# Altium project SmartMeter.PrjPCB
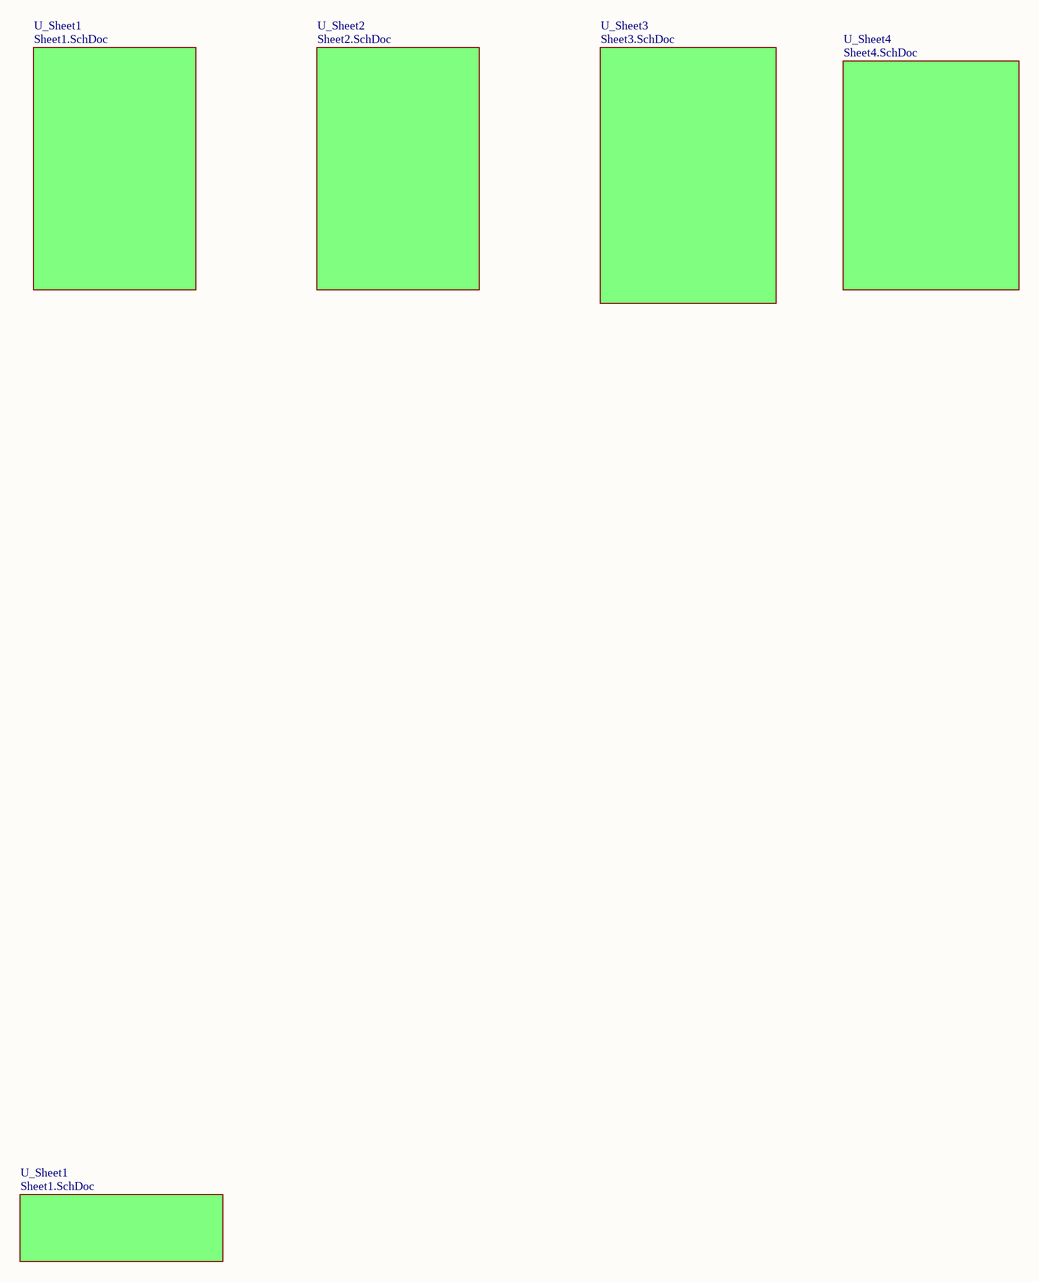
[diagram p0: SmartMeter.SchDoc]
4 sheets, 314 parts. Net scope: flat (ports and power ports of the same name join across sheets).
Board file: PCB1.PcbDoc
Sheets:
  SmartMeter.SchDoc
    U_Sheet1 = Sheet1.SchDoc
    U_Sheet1 = Sheet1.SchDoc
    U_Sheet2 = Sheet2.SchDoc
    U_Sheet3 = Sheet3.SchDoc

## Sheet SmartMeter.SchDoc: SMART METER _Main Board
size A3; SheetNumber: 3; ProjectName: Smart Meter

### Sub-sheets
U_Sheet1 = Sheet1.SchDoc: no entries
U_Sheet1 = Sheet1.SchDoc: no entries
U_Sheet2 = Sheet2.SchDoc: no entries
U_Sheet3 = Sheet3.SchDoc: no entries
U_Sheet4 = Sheet4.SchDoc (file not in this document): no entries

### Notes on the sheet
- Title
- Size:
- Date:
- A3
- Number:
- Time:
- Revision:
- Sheet
- of
- File:

## Sheet Sheet1.SchDoc
size A3
Used 2 times, as channels U_Sheet1, U_Sheet1. Parts and nets are listed once, with the designators drawn on the sheet.
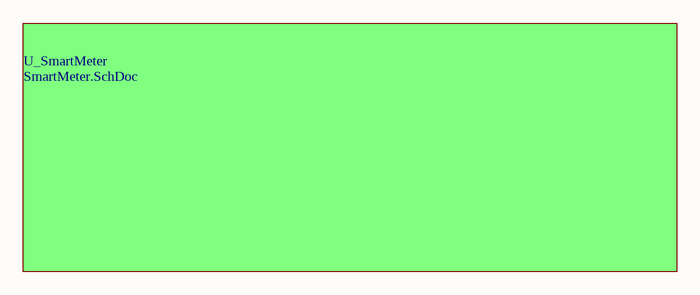
[diagram p1: Sheet1.SchDoc]

### Sub-sheets
U_SmartMeter = SmartMeter.SchDoc: no entries

### Channels
U_Sheet1: no parts or ports
U_Sheet1: no parts or ports

## Sheet Sheet2.SchDoc: SMART METER Main Board
size A3; SheetNumber: 2
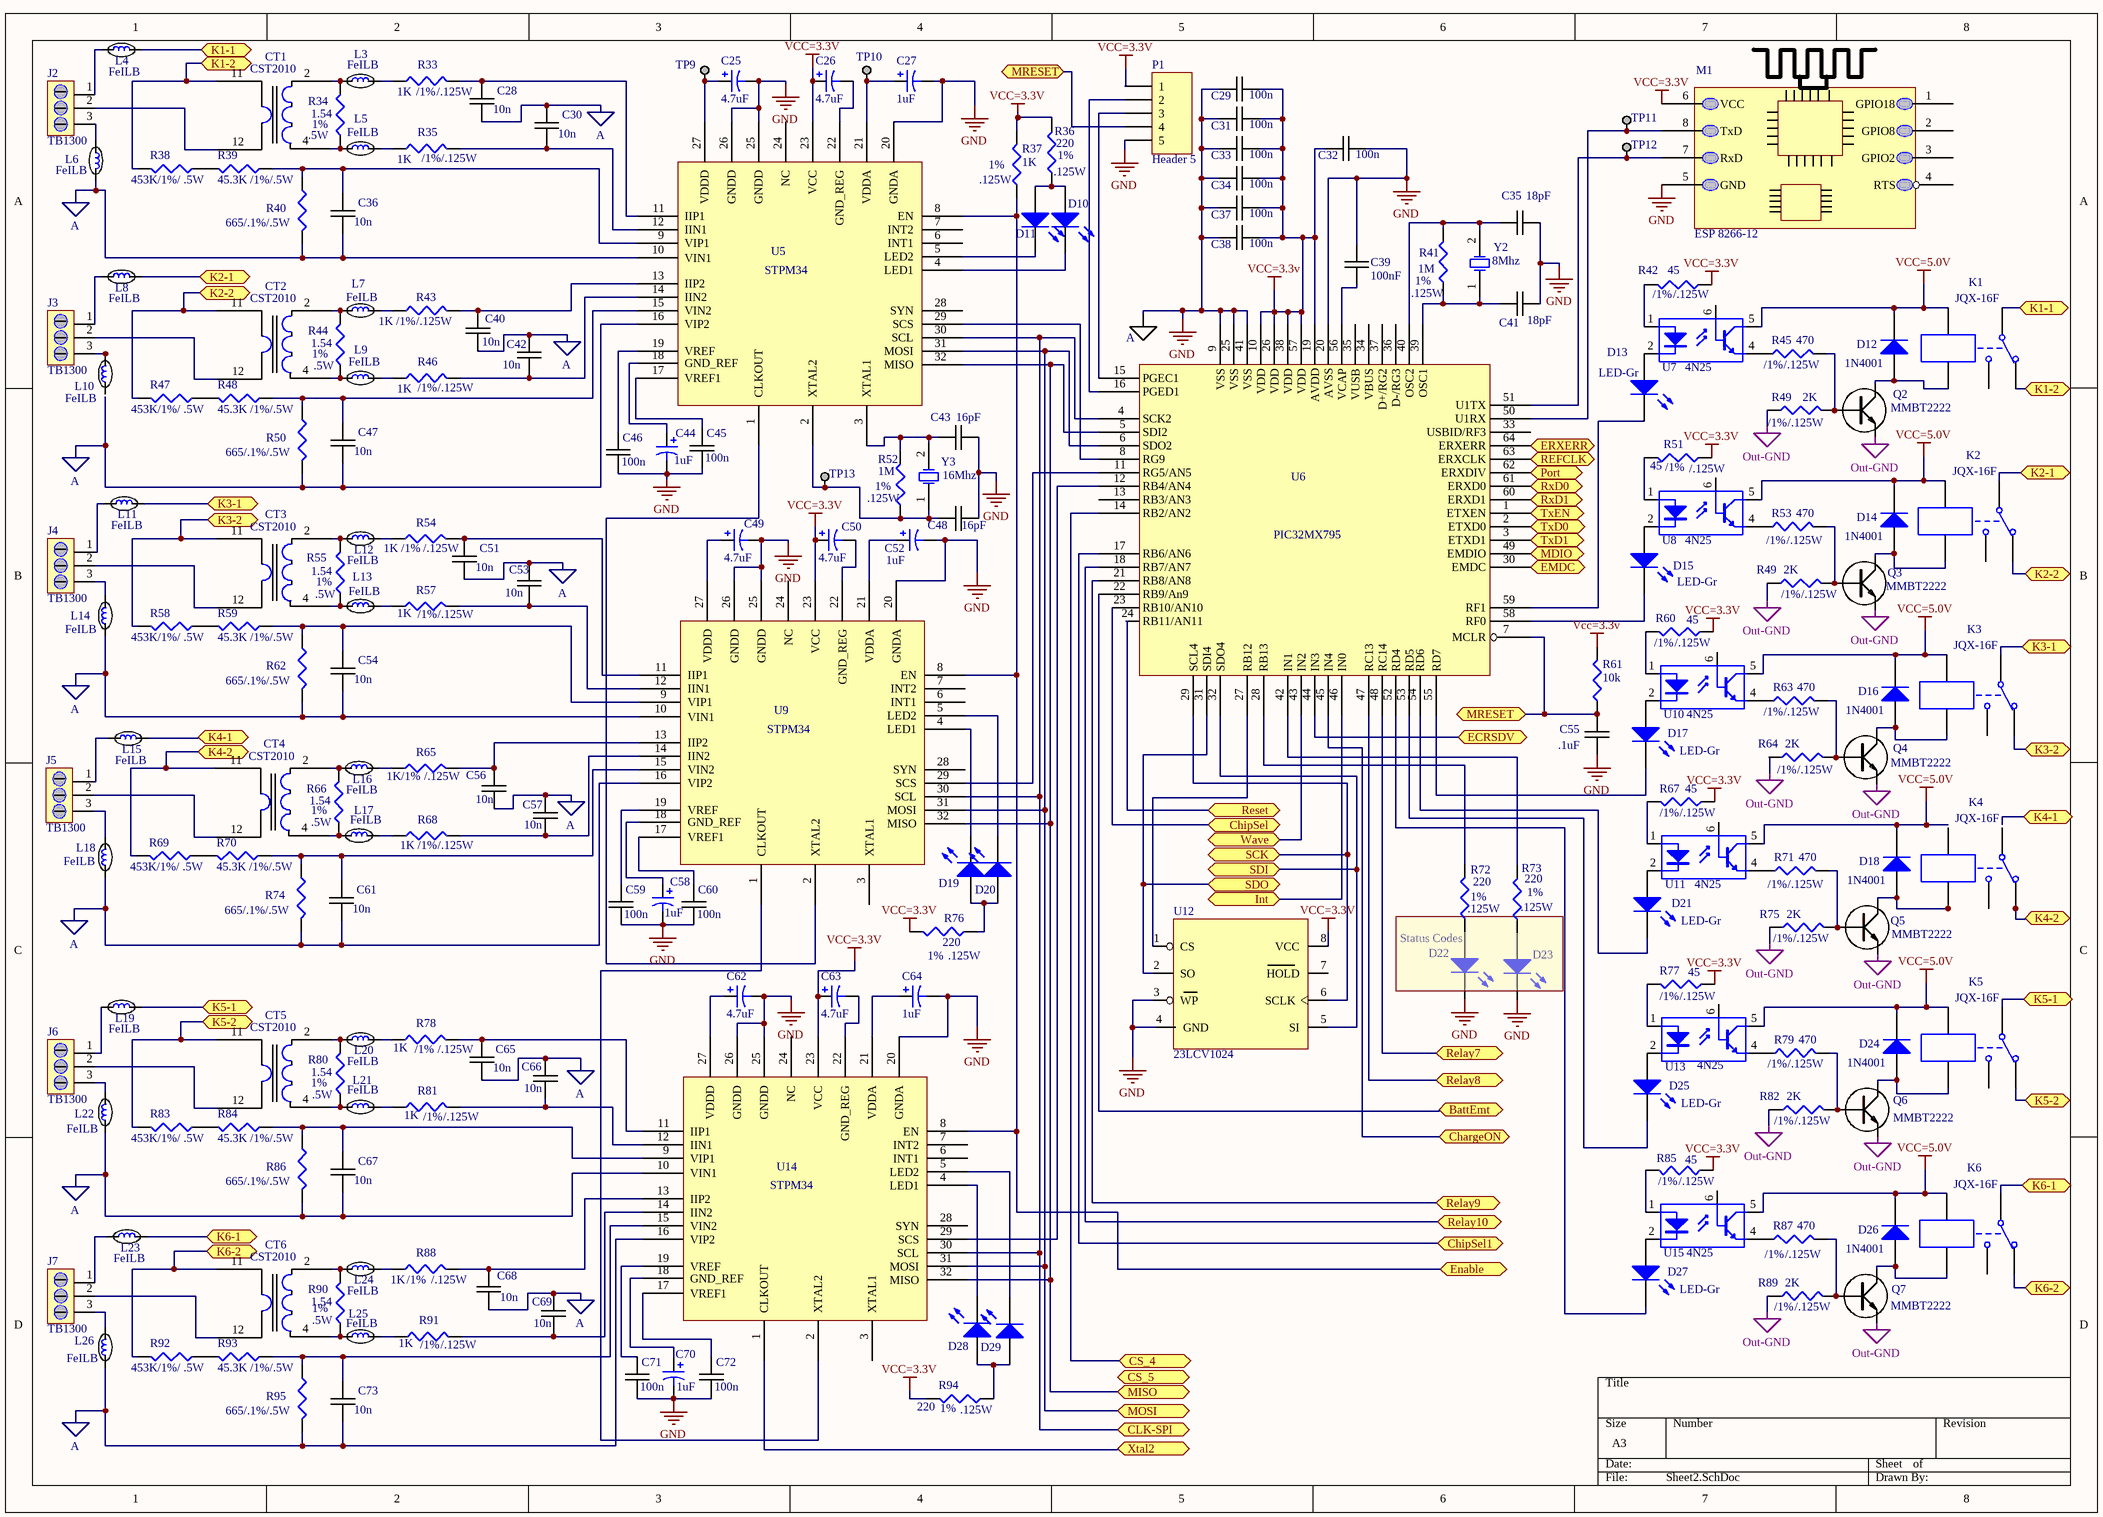
[diagram p2: Sheet2.SchDoc]

### Parts
(Parts that share a designator on the sheet are numbered #1, #2 ... from top to bottom, then left to right.)
1  AGND  [HC49/4H_SMX]  (value not drawn)
C25  4.7uF  [C0805]
C26  4.7uF  [C0805]
C27  1uF  [C0805]
C28  10n  [0805C-TBD]
C29  100n  [0805C-TBD]
C30  10n  [0805C-TBD]
C31  100n  [0805C-TBD]
C32  100n  [0805C-TBD]
C33  100n  [0805C-TBD]
C34  100n  [0805C-TBD]
C35  18pF  [0805C-TBD]
C36  10n  [0805C-TBD]
C37  100n  [0805C-TBD]
C38  100n  [0805C-TBD]
C39  100nF  [0805C-TBD]
C40  10n  [0805C-TBD]
C41  18pF  [0805C-TBD]
C42  10n  [0805C-TBD]
C43  16pF  [0805C-TBD]
C44  1uF  [C0805]
C45  100n  [0805C-TBD]
C46  100n  [0805C-TBD]
C47  10n  [0805C-TBD]
C48  16pF  [0805C-TBD]
C49  4.7uF  [C0805]
C50  4.7uF  [C0805]
C51  10n  [0805C-TBD]
C52  1uF  [C0805]
C53  10n  [0805C-TBD]
C54  10n  [0805C-TBD]
C55  .1uF  [0805C-TBD]
C56  10n  [0805C-TBD]
C57  10n  [0805C-TBD]
C58  1uF  [C0805]
C59  100n  [0805C-TBD]
C60  100n  [0805C-TBD]
C61  10n  [0805C-TBD]
C62  4.7uF  [C0805]
C63  4.7uF  [C0805]
C64  1uF  [C0805]
C65  10n  [0805C-TBD]
C66  10n  [0805C-TBD]
C67  10n  [0805C-TBD]
C68  10n  [0805C-TBD]
C69  10n  [0805C-TBD]
C70  1uF  [C0805]
C71  100n  [0805C-TBD]
C72  100n  [0805C-TBD]
C73  10n  [0805C-TBD]
CT1  CST2010  [CST2010]
CT2  CST2010  [CST2010]
CT3  CST2010  [CST2010]
CT4  CST2010  [CST2010]
CT5  CST2010  [CST2010]
CT6  CST2010  [CST2010]
D10  LED2  [3.2X1.6X1.1]  (value not drawn)
D11  LED2  [3.2X1.6X1.1]  (value not drawn)
D12  1N4001  [DO-214AC]
D13  LED-Gr  [3.2X1.6X1.1]
D14  1N4001  [DO-214AC]
D15  LED-Gr  [3.2X1.6X1.1]
D16  1N4001  [DO-214AC]
D17  LED-Gr  [3.2X1.6X1.1]
D18  1N4001  [DO-214AC]
D19  LED2  [3.2X1.6X1.1]  (value not drawn)
D20  LED2  [3.2X1.6X1.1]  (value not drawn)
D21  LED-Gr  [3.2X1.6X1.1]
D22  LED2  [3.2X1.6X1.1]  (value not drawn)
D23  LED2  [3.2X1.6X1.1]  (value not drawn)
D24  1N4001  [DO-214AC]
D25  LED-Gr  [3.2X1.6X1.1]
D26  1N4001  [DO-214AC]
D27  LED-Gr  [3.2X1.6X1.1]
D28  LED2  [3.2X1.6X1.1]  (value not drawn)
D29  LED2  [3.2X1.6X1.1]  (value not drawn)
J2  TB1300  [TB-1300-0-C]
J3  TB1300  [TB-1300-0-C]
J4  TB1300  [TB-1300-0-C]
J5  TB1300  [TB-1300-0-C]
J6  TB1300  [TB-1300-0-C]
J7  TB1300  [TB-1300-0-C]
K1  JQX-16F  [JQX-16f]
K2  JQX-16F  [JQX-16f]
K3  JQX-16F  [JQX-16f]
K4  JQX-16F  [JQX-16f]
K5  JQX-16F  [JQX-16f]
K6  JQX-16F  [JQX-16f]
L3  FeILB
L4  FeILB
L5  FeILB
L6  FeILB
L7  FeILB
L8  FeILB
L9  FeILB
L10  FeILB
L11  FeILB
L12  FeILB
L13  FeILB
L14  FeILB
L15  FeILB
L16  FeILB
L17  FeILB
L18  FeILB
L19  FeILB
L20  FeILB
L21  FeILB
L22  FeILB
L23  FeILB
L24  FeILB
L25  FeILB
L26  FeILB
M1  ESP 8266-12  [ESP_1]
P1  Header 5  [HDR1X5]
Q2  MMBT2222  [SOT23-BCE]
Q3  MMBT2222  [SOT23-BCE]
Q4  MMBT2222  [SOT23-BCE]
Q5  MMBT2222  [SOT23-BCE]
Q6  MMBT2222  [SOT23-BCE]
Q7  MMBT2222  [SOT23-BCE]
R33  1K  [0805R-10]
R34  1.54  [0805R-10]
R35  1K  [0805R-10]
R36  220  [J1-0603]
R37  1K  [J1-0603]
R38  453K/1%/ .5W  [1210R-GENERIC]
R39  45.3K /1%/.5W  [1210C-GENERIC]
R40  665/.1%/.5W  [1210C-GENERIC]
R41  1M  [J1-0603]
R42  45  [0805R-68]
R43  1K  [0805R-10]
R44  1.54  [0805R-10]
R45  470  [0805R-39]
R46  1K  [0805R-10]
R47  453K/1%/ .5W  [1210R-GENERIC]
R48  45.3K /1%/.5W  [1210C-GENERIC]
R49#1  2K  [0805R-180]
R49#2  2K  [0805R-180]
R50  665/.1%/.5W  [1210C-GENERIC]
R51  45  [0805R-68]
R52  1M  [J1-0603]
R53  470  [0805R-39]
R54  1K  [0805R-10]
R55  1.54  [0805R-10]
R57  1K  [0805R-10]
R58  453K/1%/ .5W  [1210R-GENERIC]
R59  45.3K /1%/.5W  [1210C-GENERIC]
R60  45  [0805R-68]
R61  10k  [J1-0603]
R62  665/.1%/.5W  [1210C-GENERIC]
R63  470  [0805R-39]
R64  2K  [0805R-180]
R65  1K  [0805R-10]
R66  1.54  [0805R-10]
R67  45  [0805R-68]
R68  1K  [0805R-10]
R69  453K/1%/ .5W  [1210R-GENERIC]
R70  45.3K /1%/.5W  [1210C-GENERIC]
R71  470  [0805R-39]
R72  220  [J1-0603]
R73  220  [J1-0603]
R74  665/.1%/.5W  [1210C-GENERIC]
R75  2K  [0805R-180]
R76  220  [J1-0603]
R77  45  [0805R-68]
R78  1K  [0805R-10]
R79  470  [0805R-39]
R80  1.54  [0805R-10]
R81  1K  [0805R-10]
R82  2K  [0805R-180]
R83  453K/1%/ .5W  [1210R-GENERIC]
R84  45.3K /1%/.5W  [1210C-GENERIC]
R85  45  [0805R-68]
R86  665/.1%/.5W  [1210C-GENERIC]
R87  470  [0805R-39]
R88  1K  [0805R-10]
R89  2K  [0805R-180]
R90  1.54  [0805R-10]
R91  1K  [0805R-10]
R92  453K/1%/ .5W  [1210R-GENERIC]
R93  45.3K /1%/.5W  [1210C-GENERIC]
R94  220  [J1-0603]
R95  665/.1%/.5W  [1210C-GENERIC]
TP9  TESTPOINT  [TESTPOINT]  (value not drawn)
TP10  TESTPOINT  [TESTPOINT]  (value not drawn)
TP11  TESTPOINT  [TESTPOINT]  (value not drawn)
TP12  TESTPOINT  [TESTPOINT]  (value not drawn)
TP13  TESTPOINT  [TESTPOINT]  (value not drawn)
U5  STPM34  [QFN32_M]
U6  PIC32MX795  [QFN64_N]
U7  4N25  [4N25]
U8  4N25  [4N25]
U9  STPM34  [QFN32_M]
U10  4N25  [4N25]
U11  4N25  [4N25]
U12  23LCV1024
U13  4N25  [4N25]
U14  STPM34  [QFN32_M]
U15  4N25  [4N25]
Y2  8Mhz  [R38]
Y3  16Mhz  [R38]

### Ports
BattEmt, ChargeON, ChipSel, ChipSel1, CLK-SPI, CS_4, CS_5, ECRSDV, EMDC, Enable, ERXERR, Int, K1-1, K1-2, K2-1, K2-2, K3-1, K3-2, K4-1, K4-2, K5-1, K5-2, K6-1, K6-2, MDIO, MISO, MOSI, MRESET, Port, REFCLK, Relay7, Relay8, Relay9, Relay10, Reset, RxD0, RxD1, SCK, SDI, SDO, TxD0, TxD1, TxEN, Wave, Xtal2

### Nets
A: C28.1 C30.2 C36.1 C40.1 C42.2 C47.1 C51.1 C53.2 C54.1 C56.1 C57.2 C61.1 C65.1 C66.2 C67.1 C68.1 C69.2 C73.1 L6.2 L14.1 L18.1 L22.1 L26.1 R40.2 R50.2 R62.2 R74.2 R86.2 R95.2 U5.10(VIN1) U5.16(VIP2) U9.10(VIN1) U9.16(VIP2) U14.10(VIN1) U14.16(VIP2)
GND: 1.VIN18 C25.2 C27.2 C29.2 C31.2 C32.1 C33.2 C34.2 C35.2 C37.2 C38.2 C39.2 C41.2 C43.2 C44.2 C45.1 C46.1 C48.2 C49.2 C52.2 C55.1 C58.2 C59.1 C60.1 C62.2 C64.2 C70.2 C71.1 C72.1 D22.2(K) D23.2(K) M1.5(GND) P1.5 U5.20(GNDA) U5.25(GNDD) U5.26(GNDD) U6.9(VSS) U6.20(AVSS) U6.25(VSS) U6.41(VSS) U9.20(GNDA) U9.25(GNDD) U9.26(GNDD) U12.3(WP) U12.4(GND) U14.20(GNDA) U14.25(GNDD) U14.26(GNDD)
Out-GND: Q2.E Q3.E Q4.E Q5.E Q6.E Q7.E R49#1.1 R49#2.1 R64.1 R75.1 R82.1 R89.1
VCC=3.3V: C26.1 C29.1 C31.1 C32.2 C33.1 C34.1 C37.1 C38.1 C50.1 C63.1 M1.6(VCC) P1.1 R36.2 R37.2 R42.1 R51.1 R60.1 R61.2 R67.1 R76.2 R77.1 R85.1 R94.2 U5.23(VCC) U6.10(VDD) U6.19(AVDD) U6.26(VDD) U6.38(VDD) U6.57(VDD) U9.23(VCC) U12.8(VCC) U14.23(VCC)
VCC=5.0V: D12.2(K) D14.2(K) D16.2(K) D18.2(K) D24.2(K) D26.2(K) K1.4 K2.4 K3.4 K5.4 K6.4 U7.5(C) U8.5(C) U10.5(C) U11.5(C) U13.5(C) U15.5(C)
NetC25_1: C25.1 TP9.1 U5.27(VDDD)
NetC26_2: C26.2 U5.22(GND_REG)
NetC27_1: C27.1 TP10.1 U5.21(VDDA)
NetC28_2: C28.2 R33.2 U5.11(IIP1)
NetC30_1: C30.1 R35.2 U5.12(IIN1)
NetC35_1: C35.1 R41.2 U6.40(OSC2) Y2.2(OSC2)
NetC36_2: C36.2 R39.1 R40.1 U5.9(VIP1)
NetC39_1: C39.1 U6.56(VCAP)
NetC40_2: C40.2 R43.2 U5.13(IIP2)
NetC41_1: C41.1 R41.1 U6.39(OSC1) Y2.1(OSC1)
NetC42_1: C42.1 R46.2 U5.14(IIN2)
NetC43_1: C43.1 R52.2 U5.3(XTAL1) Y3.2(OSC2)
NetC44_1: C44.1 U5.18(GND_REF)
NetC45_2: C45.2 U5.17(VREF1)
NetC46_2: C46.2 U5.19(VREF)
NetC47_2: C47.2 R48.1 R50.1 U5.15(VIN2)
NetC48_1: C48.1 R52.1 TP13.1 U5.2(XTAL2) Y3.1(OSC1)
NetC49_1: C49.1 U9.27(VDDD)
NetC50_2: C50.2 U9.22(GND_REG)
NetC51_2: C51.2 R54.2 U9.11(IIP1)
NetC52_1: C52.1 U9.21(VDDA)
NetC53_1: C53.1 R57.2 U9.12(IIN1)
NetC54_2: C54.2 R59.1 R62.1 U9.9(VIP1)
NetC55_2: C55.2 P1.4 R61.1 U6.7(MCLR) ; port MRESET
NetC56_2: C56.2 R65.2 U9.13(IIP2)
NetC57_1: C57.1 R68.2 U9.14(IIN2)
NetC58_1: C58.1 U9.18(GND_REF)
NetC59_2: C59.2 U9.19(VREF)
NetC60_2: C60.2 U9.17(VREF1)
NetC61_2: C61.2 R70.1 R74.1 U9.15(VIN2)
NetC62_1: C62.1 U14.27(VDDD)
NetC63_2: C63.2 U14.22(GND_REG)
NetC64_1: C64.1 U14.21(VDDA)
NetC65_2: C65.2 R78.2 U14.11(IIP1)
NetC66_1: C66.1 R81.2 U14.12(IIN1)
NetC67_2: C67.2 R84.1 R86.1 U14.9(VIP1)
NetC68_2: C68.2 R88.2 U14.13(IIP2)
NetC69_1: C69.1 R91.2 U14.14(IIN2)
NetC70_1: C70.1 U14.18(GND_REF)
NetC71_2: C71.2 U14.19(VREF)
NetC72_2: C72.2 U14.17(VREF1)
NetC73_2: C73.2 R93.1 R95.1 U14.15(VIN2)
NetCT1_2: CT1.2 L3.1 R34.2
NetCT1_4: CT1.4 L5.1 R34.1
NetCT1_11: CT1.11 K1.2 R38.2 ; port K1-2
NetCT1_12: CT1.12 J2.2
NetCT2_2: CT2.2 L7.1 R44.2
NetCT2_4: CT2.4 L9.1 R44.1
NetCT2_11: CT2.11 K2.2 R47.2 ; port K2-2
NetCT2_12: CT2.12 J3.2
NetCT3_2: CT3.2 L12.1 R55.2
NetCT3_4: CT3.4 L13.1 R55.1
NetCT3_11: CT3.11 K3.2 R58.2 ; port K3-2
NetCT3_12: CT3.12 J4.2
NetCT4_2: CT4.2 L16.1 R66.2
NetCT4_4: CT4.4 L17.1 R66.1
NetCT4_11: CT4.11 K4.2 R69.2 ; port K4-2
NetCT4_12: CT4.12 J5.2
NetCT5_2: CT5.2 L20.1 R80.2
NetCT5_4: CT5.4 L21.1 R80.1
NetCT5_11: CT5.11 K5.2 R83.2 ; port K5-2
NetCT5_12: CT5.12 J6.2
NetCT6_2: CT6.2 L24.1 R90.2
NetCT6_4: CT6.4 L25.1 R90.1
NetCT6_11: CT6.11 K6.2 R92.2 ; port K6-2
NetCT6_12: CT6.12 J7.2
NetD10_1: D10.1(A) D11.1(A) R36.1
NetD10_2: D10.2(K) U5.4(LED1)
NetD11_2: D11.2(K) U5.5(LED2)
NetD12_1: D12.1(A) K1.5 Q2.C
NetD13_1: D13.1(A) U7.2(K)
NetD13_2: D13.2(K) U6.59(RF1)
NetD14_1: D14.1(A) K2.5 Q3.C
NetD15_1: D15.1(A) U8.2(K)
NetD15_2: D15.2(K) U6.58(RF0)
NetD16_1: D16.1(A) K3.5 Q4.C
NetD17_1: D17.1(A) U10.2(K)
NetD17_2: D17.2(K) U6.55(RD7)
NetD18_1: D18.1(A) K4.5 Q5.C
NetD19_1: D19.1(A) D20.1(A) R76.1
NetD19_2: D19.2(K) U9.4(LED1)
NetD20_2: D20.2(K) U9.5(LED2)
NetD21_1: D21.1(A) U11.2(K)
NetD21_2: D21.2(K) U6.54(RD6)
NetD22_1: D22.1(A) R72.1
NetD23_1: D23.1(A) R73.1
NetD24_1: D24.1(A) K5.5 Q6.C
NetD25_1: D25.1(A) U13.2(K)
NetD25_2: D25.2(K) U6.53(RD5)
NetD26_1: D26.1(A) K6.5 Q7.C
NetD27_1: D27.1(A) U15.2(K)
NetD27_2: D27.2(K) U6.52(RD4)
NetD28_1: D28.1(A) D29.1(A) R94.1
NetD28_2: D28.2(K) U14.4(LED1)
NetD29_2: D29.2(K) U14.5(LED2)
NetD31_2: U6.48(RC14) ; port Relay7
NetD35_2: U6.47(RC13) ; port Relay8
NetD37_2: U6.21(RB8/AN8) ; port Relay9
NetD39_2: U6.18(RB7/AN7) ; port Relay10
NetJ2_1: J2.1 L4.1
NetJ2_3: J2.3 L6.1
NetJ3_1: J3.1 L8.1
NetJ3_3: J3.3 L10.2
NetJ4_1: J4.1 L11.1
NetJ4_3: J4.3 L14.2
NetJ5_1: J5.1 L15.1
NetJ5_3: J5.3 L18.2
NetJ6_1: J6.1 L19.1
NetJ6_3: J6.3 L22.2
NetJ7_1: J7.1 L23.1
NetJ7_3: J7.3 L26.2
NetK1_1: K1.1 L4.2 ; port K1-1
NetK2_1: K2.1 L8.2 ; port K2-1
NetK3_1: K3.1 L11.2 ; port K3-1
NetK5_1: K5.1 L19.2 ; port K5-1
NetK6_1: K6.1 L23.2 ; port K6-1
NetL3_2: L3.2 R33.1
NetL5_2: L5.2 R35.1
NetL7_2: L7.2 R43.1
NetL9_2: L9.2 R46.1
NetL12_2: L12.2 R54.1
NetL13_2: L13.2 R57.1
NetL15_2: L15.2 ; port K4-1
NetL16_2: L16.2 R65.1
NetL17_2: L17.2 R68.1
NetL20_2: L20.2 R78.1
NetL21_2: L21.2 R81.1
NetL24_2: L24.2 R88.1
NetL25_2: L25.2 R91.1
NetM1_7: M1.7(RxD) TP12.1 U6.51(U1TX)
NetM1_8: M1.8(TxD) TP11.1 U6.50(U1RX)
NetM2_2: U6.24(RB11/AN11) ; port Reset
NetM2_3: U6.43(IN2) ; port Wave
NetM2_4: U6.46(IN0) ; port Int
NetM2_5: U6.32(SDO4) U12.5(SI) ; port SDI
NetM2_6: U6.29(SCL4) U12.6(SCLK) ; port SCK
NetM2_7: U6.31(SDI4) U12.2(SO) ; port SDO
NetM2_8: U6.23(RB10/AN10) ; port ChipSel
NetP1_2: P1.2 U6.16(PGED1)
NetP1_3: P1.3 U6.15(PGEC1)
NetQ2_B: Q2.B R45.2 R49#1.2
NetQ3_B: Q3.B R49#2.2 R53.2
NetQ4_B: Q4.B R63.2 R64.2
NetQ5_B: Q5.B R71.2 R75.2
NetQ6_B: Q6.B R79.2 R82.2
NetQ7_B: Q7.B R87.2 R89.2
NetR37_1: R37.1 U5.8(EN) U9.8(EN) U14.8(EN) ; port Enable
NetR38_1: R38.1 R39.2
NetR42_2: R42.2 U7.1(A)
NetR45_1: R45.1 U7.4(E)
NetR47_1: R47.1 R48.2
NetR51_2: R51.2 U8.1(A)
NetR53_1: R53.1 U8.4(E)
NetR58_1: R58.1 R59.2
NetR60_2: R60.2 U10.1(A)
NetR63_1: R63.1 U10.4(E)
NetR67_2: R67.2 U11.1(A)
NetR69_1: R69.1 R70.2
NetR71_1: R71.1 U11.4(E)
NetR72_2: R72.2 U6.28(RB13)
NetR73_2: R73.2 U6.42(IN1)
NetR77_2: R77.2 U13.1(A)
NetR79_1: R79.1 U13.4(E)
NetR83_1: R83.1 R84.2
NetR85_2: R85.2 U15.1(A)
NetR87_1: R87.1 U15.4(E)
NetR92_1: R92.1 R93.2
NetU5_1: U5.1(CLKOUT) U9.2(XTAL2)
NetU5_29: U5.29(SCS) U6.8(RG9)
NetU5_30: U5.30(SCL) U6.4(SCK2) U9.30(SCL) U14.30(SCL) ; port CLK-SPI
NetU5_31: U5.31(MOSI) U6.6(SDO2) U9.31(MOSI) U14.31(MOSI) ; port MOSI
NetU5_32: U5.32(MISO) U6.5(SDI2) U9.32(MISO) U14.32(MISO) ; port MISO
NetU6_1: U6.1(ETXEN) ; port TxEN
NetU6_2: U6.2(ETXD0) ; port TxD0
NetU6_3: U6.3(ETXD1) ; port TxD1
NetU6_11: U6.11(RG5/AN5) U9.29(SCS)
NetU6_12: U6.12(RB4/AN4) U14.29(SCS)
NetU6_14: U6.14(RB2/AN2) ; port CS_4
NetU6_17: U6.17(RB6/AN6) ; port ChipSel1
NetU6_22: U6.22(RB9/An9) ; port BattEmt
NetU6_27: U6.27(RB12) U12.1(CS)
NetU6_30: U6.30(EMDC) ; port EMDC
NetU6_44: U6.44(IN3) ; port ECRSDV
NetU6_45: U6.45(IN4) ; port ChargeON
NetU6_49: U6.49(EMDIO) ; port MDIO
NetU6_60: U6.60(ERXD1) ; port RxD1
NetU6_61: U6.61(ERXD0) ; port RxD0
NetU6_62: U6.62(ERXDIV) ; port Port
NetU6_63: U6.63(ERXCLK) ; port REFCLK
NetU6_64: U6.64(ERXERR) ; port ERXERR
NetU9_1: U9.1(CLKOUT) U14.2(XTAL2)
NetU14_1: U14.1(CLKOUT) ; port Xtal2

Not connected (* = marked no-connect by the designer): K1 3; K2 3; K3 3; K4 1 3 4; K5 3; K6 3; L10 1; M1 1(GPIO18) 2(GPIO8) 3(GPIO2) 4(RTS); U5 6(INT1) 7(INT2) 24(NC) 28(SYN); U6 13(RB3/AN3) 33(USBID/RF3) 34(VBUS) 35(VUSB) 36(D-/RG3) 37(D+/RG2); U7 6(B); U8 6(B); U9 3(XTAL1) 6(INT1) 7(INT2) 24(NC) 28(SYN); U10 6(B); U11 6(B); U12 7(HOLD); U13 6(B); U14 3(XTAL1) 6(INT1) 7(INT2) 24(NC) 28(SYN); U15 6(B)

### Notes on the sheet
- (near R33) /1%
- /.125W
- .5W
- 1%
- (near R35) /1%/.125W
- (near R37) .125W
- (near R37) 1%
- (near R36) .125W
- (near R36) 1%
- (near R43) /1%
- (near R43) /.125W
- (near R41) .125W
- (near R41) 1%
- (near R42) /1%
- (near R42) /.125W
- (near R46) /1%
- (near R46) /.125W
- (near R45) /1%
- (near R45) /.125W
- (near R49#1) /1%
- (near R49#1) /.125W
- (near R52) .125W
- (near R52) 1%
- (near R51) /1%
- (near R51) /.125W
- (near R55) 1%
- (near R54) /1%
- (near R53) /1%
- (near R53) /.125W
- (near R57) /1%
- (near R57) /.125W
- (near R60) /1%
- (near R60) /.125W
- (near R49#2) /1%
- (near R63) /1%
- (near R63) /.125W
- (near R65) /1%
- (near R65) /.125W
- (near R64) /1%
- (near R64) /.125W
- (near R68) /1%
- (near R68) /.125W
- (near R67) /1%
- (near R67) /.125W
- (near R72) .125W
- (near R72) 1%
- (near R73) .125W
- (near R73) 1%
- (near R71) /1%
- (near R71) /.125W
- (near R76) 1%
- (near R76) .125W
- Status Codes
- /1%
- (near R75) /1%
- (near R75) /.125W
- (near R78) /1%
- (near R79) /1%
- (near R79) /.125W
- (near R81) /1%
- (near R81) /.125W
- (near R82) /1%
- (near R82) /.125W
- (near R85) /1%
- (near R85) /.125W
- (near R87) /1%
- (near R87) /.125W
- (near R88) /1%
- (near R88) /.125W
- (near R89) /1%
- (near R89) /.125W
- (near R91) /1%
- (near R91) /.125W
- (near R94) 1%
- (near R94) .125W
- (in symbol AGND) A

### Library data of the parts
C25 C26 C49 C50 C62 C63 = Cap Pol3: Polarized Capacitor (Surface Mount); Manufacturer: Kemet; Mfr.PN#: T491A106K006AT7280; Value: 100pF; Suppl.PN#: 399-10116-ND; Published: 8-Jun-2000; LatestRevisionDate: 29-May-2009; LatestRevisionNote: IPC-7351 Footprint Added.; PackageReference: C0805; Publisher: Altium Limited; PackageDescription: Chip Capacitor; Supplier: Digi-Key; SMD: 1206; Price: .065
C27 C44 C52 C58 C64 C70 = Cap Pol3: Polarized Capacitor (Surface Mount); Manufacturing: Vishay  Spraque; Mfr.PN#: 298D105X06R3k2T; Value: 100pF; Suppl.PN#: 298D105X06R3k2T-ND; Published: 8-Jun-2000; LatestRevisionDate: 29-May-2009; LatestRevisionNote: IPC-7351 Footprint Added.; PackageReference: C0805; Publisher: Altium Limited; PackageDescription: Chip Capacitor; Supplier: Digi-Key; SMD: 0402; Price: .4
C28 C30 C36 C40 C42 C47 C51 C53 C54 C56 C57 C61 C65-C69 C73 = 0805C-18PF-50V-C0G-JOH: CAPACITOR 0805 CERAMIC; Manufacturer: Murata Electronics; Mfr.PN#: CRM155R71H103KA880; Suppl.PN#: 490-4516-2-ND; Supplier 1: Digi-Key; Supplier Part Number 1: 709-1171-2-ND; Value: 10n; mfr PN: *; Package reference: 0805-TBD; Supplier: Digi-Key; smd: 0402; Price: .002
C29 C31-C34 C37 C38 C45 C46 C59 C60 C71 C72 = 0805C-18PF-50V-C0G-JOH: CAPACITOR 0805 CERAMIC; Manufacturer: Murata Electronnics; Mfr.PN#: GRM155R61A104KA01; Value: 10n; Suppl.PN#: 490-1318-2-ND; Pprice: 0.0021; Supplier 1: Digi-Key; Supplier Part Number 1: 709-1171-2-ND; mfr PN: *; Package reference: 0805-TBD; Supplier: Digi-Key; SMD: 0402
C35 C39 C41 = 0805C-18PF-50V-C0G-JOH: CAPACITOR 0805 CERAMIC; Supplier 1: Digi-Key; Supplier Part Number 1: 709-1171-2-ND
C43 C48 = 0805C-18PF-50V-C0G-JOH: CAPACITOR 0805 CERAMIC; Manufacturer: Kemet; Mfr.PN#: C0402C160J4GACTU; Suppl.PN#: 399-8947-2-ND; Supplier 1: Digi-Key; Supplier Part Number 1: 709-1171-2-ND; Supplier: Digi-Key; Price: .00987; SMD: 0402
C55 = 0805C-18PF-50V-C0G-JOH: CAPACITOR 0805 CERAMIC; Manufacturer: Samsung; Mfr.PN#: CL05B104KO5NNC; Suppl.PN#: 1276-1001-2-ND; Supplier 1: Digi-Key; Supplier Part Number 1: 709-1171-2-ND; Supplier: Digi-Key; Price: .00206; SMD: 0402
CT1-CT6 = CurrentTransf: Manufacturer: Coilcraft; Mfr.PN#: CST2010-200L; Price: 1.14
D10 D11 D19 D20 D22 D23 = LED2: Typical RED, GREEN, YELLOW, AMBER GaAs LED; Published: 8-Jun-2000; LatestRevisionDate: 17-Jul-2002; LatestRevisionNote: Re-released for DXP Platform.; PackageVersion: Feb-2002; PackageReference: 3.2X1.6X1.1; Publisher: Altium Limited; PackageDescription: SM LED; 2 Flat Leads
D12 D14 D16 D18 D24 D26 = Diode 1N4001: 1 Amp General Purpose Rectifier; Manufacturer: Diode Incorporated; Mfr.PN#: S1AB-13; Suppl.PN#: S1ABD1TR-ND; Published: 8-Jun-2000; LatestRevisionDate: 17-Jul-2002; LatestRevisionNote: Re-released for DXP Platform.; DatasheetVersion: 1998; PackageVersion: Aug-1999; PackageReference: DO-41; Publisher: Altium Limited; PackageDescription: Diode, Axial; Body 5.2 x 2.7 mm (LxDia. max), Lead Dia. 0.86 mm (max); Code_JEDEC: DO-204-AL; ComponentLink1Description: Manufacturer Link; ComponentLink1URL: http://www.fairchildsemi.com/; ComponentLink2Description: Datasheet; ComponentLink2URL: http://www.fairchildsemi.com/ds/1N%2F1N4001.pdf; Supplier: Digi-Key; Price: .1
D13 D15 D17 D21 D25 D27 = LED2: Typical RED, GREEN, YELLOW, AMBER GaAs LED; Manufacturer: Lite-On Inc; Mfr.PN#: LTST-C191KGKT; Suppl.PN#: 160-1446-2-ND; Published: 8-Jun-2000; LatestRevisionDate: 17-Jul-2002; LatestRevisionNote: Re-released for DXP Platform.; PackageVersion: Feb-2002; PackageReference: 3.2X1.6X1.1; Publisher: Altium Limited; PackageDescription: SM LED; 2 Flat Leads; Supplier: Digi-Key; Price: .04
D28 D29 = LED2: Typical RED, GREEN, YELLOW, AMBER GaAs LED; Manufacturer: Lite-On Inc; Mfr.PN#: LTST-C191KRKT; Suppl.PN#: 160-1447-2-ND; Published: 8-Jun-2000; LatestRevisionDate: 17-Jul-2002; LatestRevisionNote: Re-released for DXP Platform.; PackageVersion: Feb-2002; PackageReference: 3.2X1.6X1.1; Publisher: Altium Limited; PackageDescription: SM LED; 2 Flat Leads; Price: .04; Supplier: Digi-Key
J2-J7 = TermBlock-2: Manufacturer: SCED Electronics Co.Ltd China; Mfr.PN#: TB1300-00-C; Price: .3
K1-K6 = Relay-SPDT: Single-Pole Dual-Throw Relay; Manufacturer: YUEQING HENGWEI Electronics CO,Ltd; Mfr.PN#: JQX-16F(T91)30A1CDC5; Published: 24-Mar-1999; LatestRevisionDate: 17-Jul-2002; LatestRevisionNote: Re-released for DXP Platform.; PackageReference: MODULE5B; Publisher: Altium Limited; Supplier: Shanghai Shinvo Electric Co.Ltd; Price: .2
L3-L26 = FerrBeads/ILBB: Manufacturer: Brand Samsung; Mfr.PN#: C1M10J152NC; Suppl.PN#: 1276-6326-1-ND; Supplier: Digi-Key; Price: .027
M1 = ESP 8266
P1 = Header 5: Header, 5-Pin; LatestRevisionDate: 17-Jul-2002; LatestRevisionNote: Re-released for DXP Platform.; Publisher: Altium Limited
Q2-Q7 = MMBT2222: BC847 SMALL SIGNAL NPN TRANSISTOR; Manufacturer: Diodes  Inc.; Mfr.PN#: MMBT2222A-7-F; Suppl.PN#: MMBT2222A-FDICT-ND; Supplier 1: Digi-Key; Supplier Part Number 1: MMBT2222A-FDICT-ND; Supplier: Digi-Key; Package: SOT-323; Price: .03
R33 R35 R43 R46 R54 R57 R65 R68 R78 R81 R88 R91 = Res3: Resistor; Manufacturer: Stackpole Electronics; Mfr.PN#: RNCP1206FTD1K00; Value: 1K 1%; Suppl.PN#: RNCP1206FTD1K00TR-ND; Published: 8-Jun-2000; LatestRevisionDate: 29-May-2009; LatestRevisionNote: IPC-7351 Footprint Added.; PackageReference: J1-0603; Publisher: Altium Limited; PackageDescription: Chip Resistor; Supplier: Digi-Key; Price: .05
R34 R44 R55 R66 R80 R90 = Res3: Resistor; Manufacturer: Vishay Pale; Mfr.PN#: CR0W12061R54FKEAHP; Value: 1K 1%; Suppl.PN#: 541-1.54UTR-ND; Published: 8-Jun-2000; LatestRevisionDate: 29-May-2009; LatestRevisionNote: IPC-7351 Footprint Added.; PackageReference: J1-0603; Publisher: Altium Limited; PackageDescription: Chip Resistor; Supplier: Digi-Key; Price: .05; SMD: 1206
R36 R72 R73 R76 R94 = Res3: Resistor; Manufacturer: Stackpole Electronics; Mfr.PN#: RMCF0805FT220R; Value: 1K 1%; Suppl.PN#: RMCF0805FT220RTR-ND; Published: 8-Jun-2000; LatestRevisionDate: 29-May-2009; LatestRevisionNote: IPC-7351 Footprint Added.; PackageReference: J1-0603; Publisher: Altium Limited; PackageDescription: Chip Resistor; manufacture P/N: *; Supplier: Digi-Key; Price: .0027
R37 = Res3: Resistor; Manufacturer: Stackpole; Mfr.PN#: RMCF0805FT1K00; Value: 1K/.125W/1%; Suppl.PN#: RMCF0805FT1K00TR-ND; Published: 8-Jun-2000; LatestRevisionDate: 29-May-2009; LatestRevisionNote: IPC-7351 Footprint Added.; PackageReference: J1-0603; Publisher: Altium Limited; PackageDescription: Chip Resistor; mfr PN: *; Supplier: Digi-Key; Price: .00266
R38 R47 R58 R69 R83 R92 = Res3: Resistor; Manufacturer: Panasonic  Co; Mfr.PN#: ERJ-P14F4533U; Value: 175k/ .5 W 1%; Suppl.PN#: P16125TR-ND; Published: 8-Jun-2000; LatestRevisionDate: 29-May-2009; LatestRevisionNote: IPC-7351 Footprint Added.; PackageReference: J1-0603; Publisher: Altium Limited; PackageDescription: Chip Resistor; mfr PN: *; Package Reference: 1206; Supplier: Digi-Key; SMD: 1210; Price: .055
R39 R48 R59 R70 R84 R93 = Res3: Resistor; Manufacturer: Panasonic Co; Mfr.PN#: ERJ-14NF-4532U; Value: 100k /.5 W 1%; Suppl.PN#: P45.3KAATR-ND; Published: 8-Jun-2000; LatestRevisionDate: 29-May-2009; LatestRevisionNote: IPC-7351 Footprint Added.; PackageReference: J1-0603; Publisher: Altium Limited; PackageDescription: Chip Resistor; mfr PN: *; Package Reference: 1206; Supplier: Digi-key; SMD: 1210; Price: .035
R40 R50 R62 R74 R86 R95 = Res3: Resistor; Manufacturer: Panasonic Co; Mfr.PN#: ERJ-P06F6650V; Value: 3 .125W 1%; Suppl.PN#: P16076TR-ND; Published: 8-Jun-2000; LatestRevisionDate: 29-May-2009; LatestRevisionNote: IPC-7351 Footprint Added.; PackageReference: J1-0603; Publisher: Altium Limited; PackageDescription: Chip Resistor; Supplier: Digi-Key; SMD: 0805; Price: .02
R41 R52 = Res3: Resistor; Manufacturer: Stackpole Electronics; Mfr.PN#: RMCF0805FT1M00; Value: 1K 1%; Suppl.PN#: RMCF0805FT1M00TR-ND; Published: 8-Jun-2000; LatestRevisionDate: 29-May-2009; LatestRevisionNote: IPC-7351 Footprint Added.; PackageReference: J1-0603; Publisher: Altium Limited; PackageDescription: Chip Resistor; manufacture P/N: *; Supplier: Digi-Key; Price: .0027
R42 R51 R60 R67 R77 R85 = Res3: Resistor; Manufacrturer: Vishay Dale; Mfr.PN#: CRCW080545R0FKTA; Value: 45/.125/1%; Suppl.PN#: CRCW080545R0FKTA-ND; Published: 8-Jun-2000; LatestRevisionDate: 29-May-2009; LatestRevisionNote: IPC-7351 Footprint Added.; PackageReference: J1-0603; Publisher: Altium Limited; PackageDescription: Chip Resistor; mfr PN: *; Supplier: Digi-Key
R45 R53 R63 R71 R79 R87 = Res3: Resistor; Manufacturer: Stackpole electronics; Mfr.PN#: RMCF0805FT470R; Value: 470/.125W/1%; Suppl.PN#: RMCF0805FT470RtR-ND; Published: 8-Jun-2000; LatestRevisionDate: 29-May-2009; LatestRevisionNote: IPC-7351 Footprint Added.; PackageReference: J1-0603; Publisher: Altium Limited; PackageDescription: Chip Resistor; Supplier: Digi-Key; Price: .003
R49#1 R49#2 R64 R75 R82 R89 = Res3: Resistor; Manufacturer: Stackpole Electronics; Mfr.PN#: RMCF0805FT2K00; Value: 2K/.125W/1%; Suppl.PN#: RMCF0805FT2K00-ND; Published: 8-Jun-2000; LatestRevisionDate: 29-May-2009; LatestRevisionNote: IPC-7351 Footprint Added.; PackageReference: J1-0603; Publisher: Altium Limited; PackageDescription: Chip Resistor; Supplier: Digi-Key; Price: .033
R61 = Res3: Resistor; Value: 10k/.125W/1%; Published: 8-Jun-2000; LatestRevisionDate: 29-May-2009; LatestRevisionNote: IPC-7351 Footprint Added.; PackageReference: J1-0603; Publisher: Altium Limited; PackageDescription: Chip Resistor
TP9-TP13 = TESTPOINT: TESTPOINT SCOPE GRABBER; Manufacturer Part Number: 5010; Manufacturer: Keystone Electronics; Reel: TH; Supplier 1: Digi-Key; Supplier Part Number 1: 5010K-ND
U5 U9 U14 = STPM34: Manufacturer: STMicroelectronic; Mfr.PN#: STPM34TR; Suppl.PN#: 497-14670-1-ND; Supplier: Digi-Key; Price: 1.16
U6 = PIC32MX534F064F: Manufacturer: Microchip; Mfr.PN#: PIC32MX795F512H-80I/PT; Suppl.PN#: 1778989; Supplier: Farnel; Price: 5.16
U7 U8 U10 U11 U13 U15 = Optoisolator2: 5 Pin Mini Flat Pack Optocoupler; Manufacturer: Avago Technologies; Mfr.PN#: 4N25-300E; Suppl.PN#: 4N25-300; Published: 24-Mar-1999; LatestRevisionDate: 04-Mar-2005; LatestRevisionNote: PCB Footprint replaced, Sch pins re-numbered.; DatasheetVersion: Apr-2004; PackageReference: SOP5(6); Publisher: Altium Limited; PackageDescription: Small Outline; 6 Leads (1 Absent); Body Width 4.4 mm; Pitch 1.27 mm; Supplier: Arrow; Price: .1273
Y2 = XTAL: Crystal Oscillator; Manufacturer: Abracon; Mfr.PN#: ABLS-8.000MHZB4-T; Suppl.PN#: 53-10212-2-ND; Published: 8-Jun-2000; LatestRevisionDate: 17-Jul-2002; LatestRevisionNote: Re-released for DXP Platform.; PackageReference: R38; Publisher: Altium Limited; PackageDescription: Crystal, Thru-Hole; 2 Leads; Body 3.1 x 8.2 mm (Dia.xH); Supplier: Digi-Key; Price: .137
Y3 = XTAL: Crystal Oscillator; Manufacturer: Abracon; Mfr.PN#: ABLS3-16.000MHz-D4Y-T; Suppl.PN#: 535-10852-2-ND; Published: 8-Jun-2000; LatestRevisionDate: 17-Jul-2002; LatestRevisionNote: Re-released for DXP Platform.; PackageReference: R38; Publisher: Altium Limited; PackageDescription: Crystal, Thru-Hole; 2 Leads; Body 3.1 x 8.2 mm (Dia.xH); Supplier: Digi-Key; Price: .288

## Sheet Sheet3.SchDoc
size A3; SheetNumber: 3
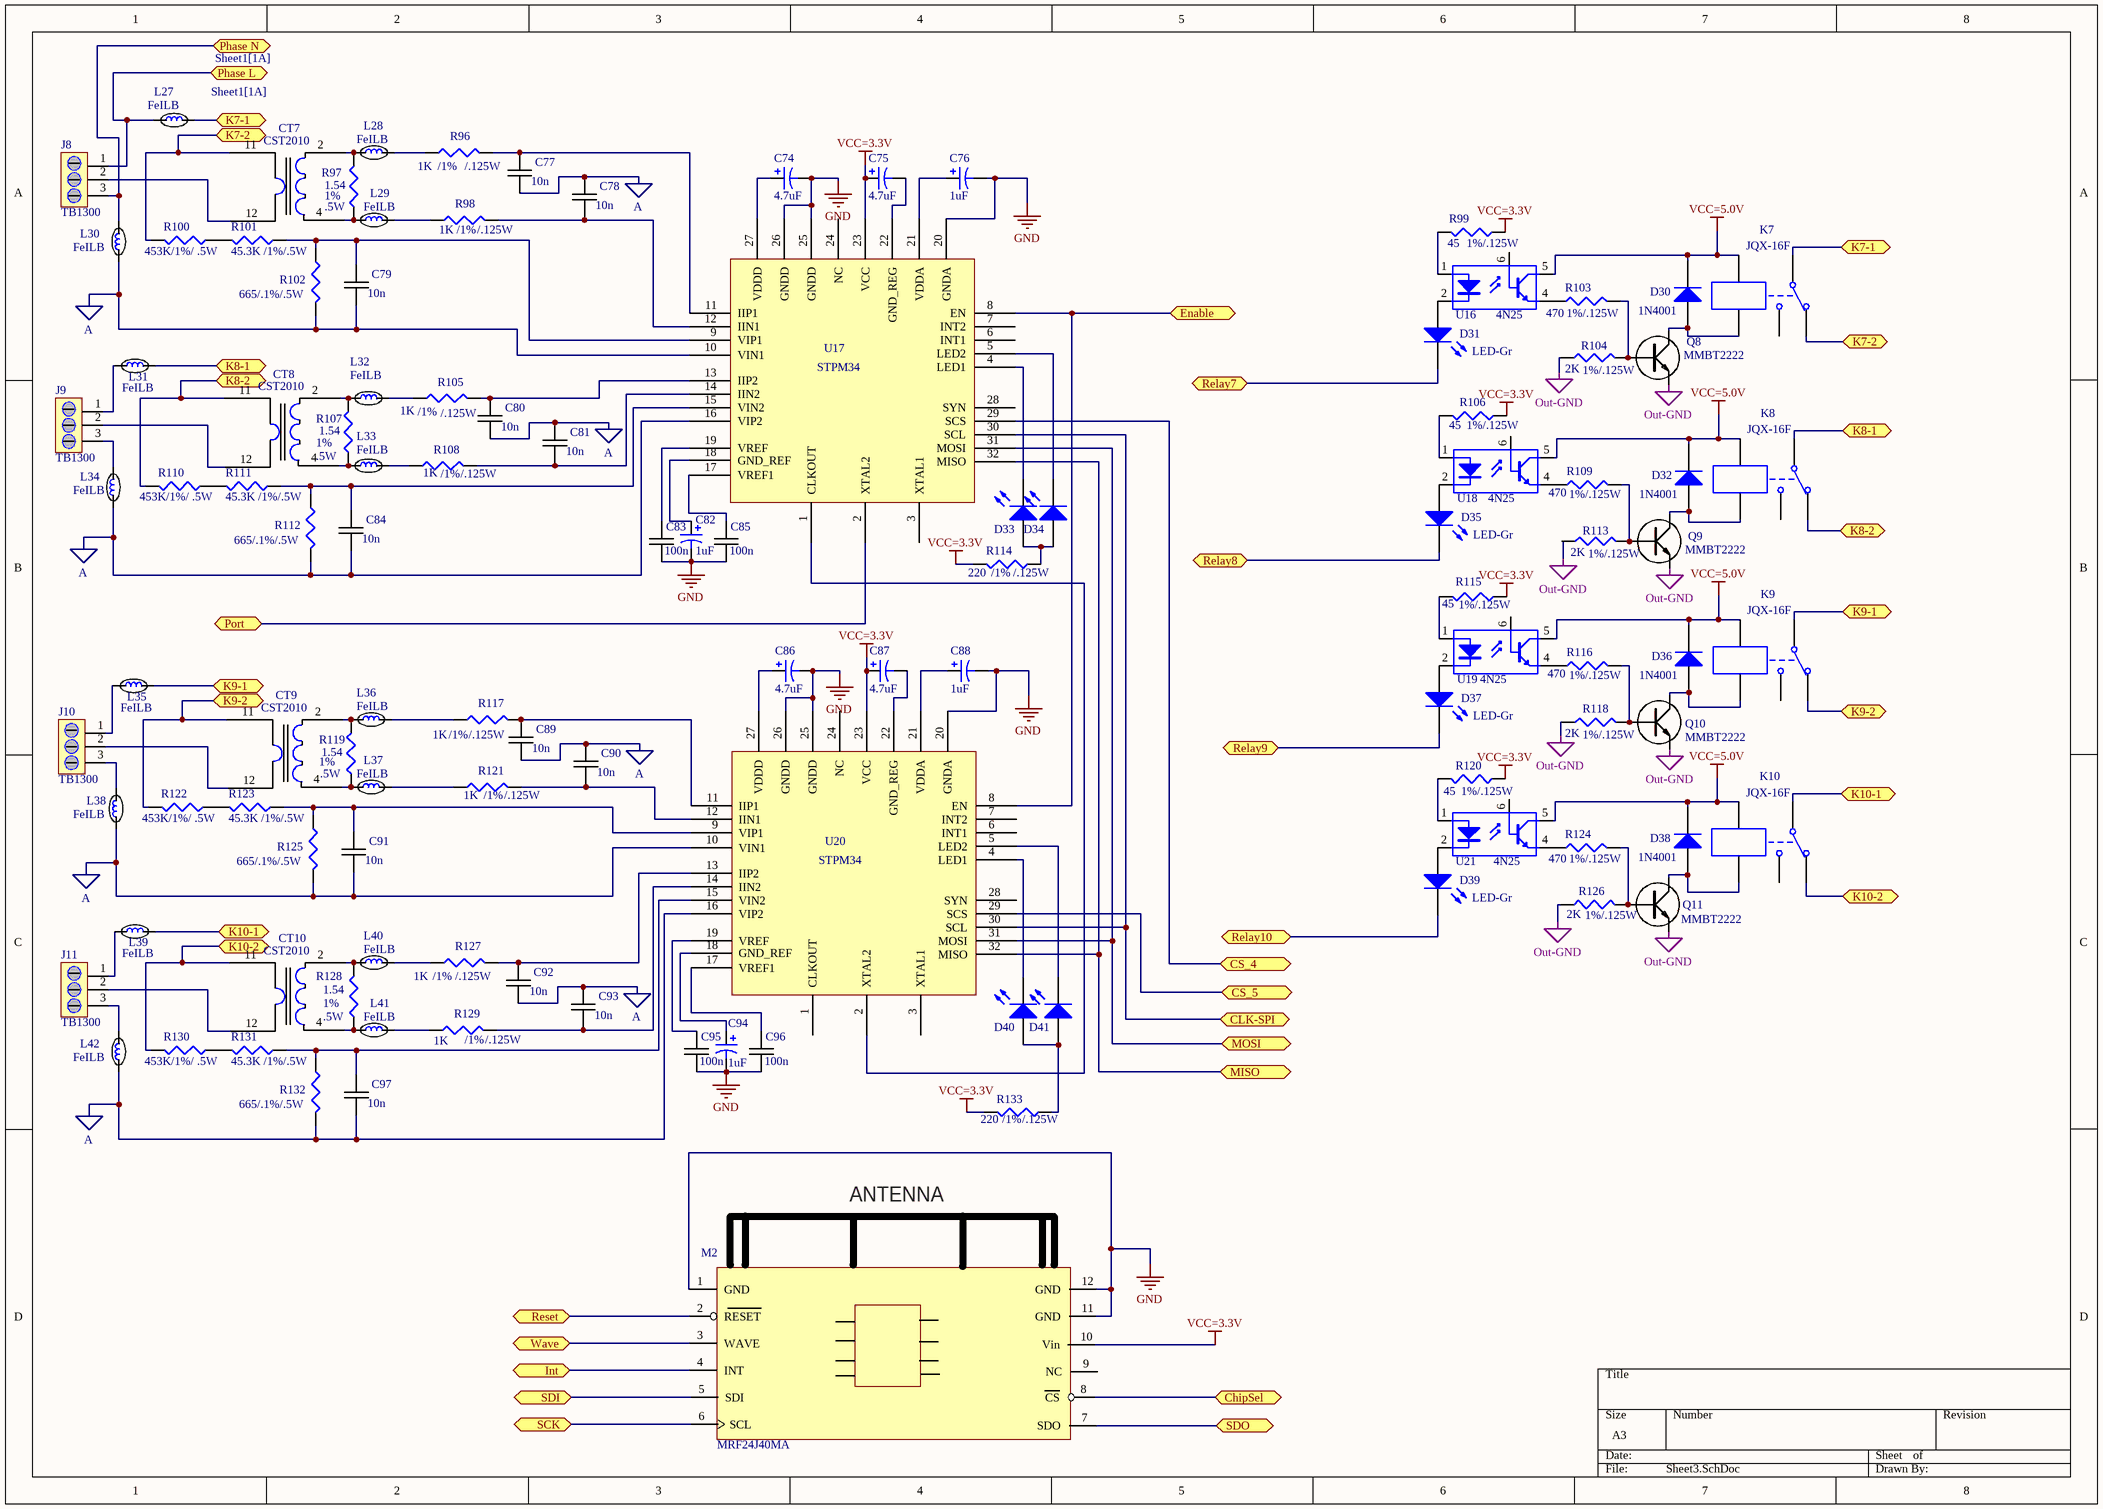
[diagram p3: Sheet3.SchDoc]

### Parts
C74  4.7uF  [C0805]
C75  4.7uF  [C0805]
C76  1uF  [C0805]
C77  10n  [0805C-TBD]
C78  10n  [0805C-TBD]
C79  10n  [0805C-TBD]
C80  10n  [0805C-TBD]
C81  10n  [0805C-TBD]
C82  1uF  [C0805]
C83  100n  [0805C-TBD]
C84  10n  [0805C-TBD]
C85  100n  [0805C-TBD]
C86  4.7uF  [C0805]
C87  4.7uF  [C0805]
C88  1uF  [C0805]
C89  10n  [0805C-TBD]
C90  10n  [0805C-TBD]
C91  10n  [0805C-TBD]
C92  10n  [0805C-TBD]
C93  10n  [0805C-TBD]
C94  1uF  [C0805]
C95  100n  [0805C-TBD]
C96  100n  [0805C-TBD]
C97  10n  [0805C-TBD]
CT7  CST2010  [CST2010]
CT8  CST2010  [CST2010]
CT9  CST2010  [CST2010]
CT10  CST2010  [CST2010]
D30  1N4001  [DO-214AC]
D31  LED-Gr  [3.2X1.6X1.1]
D32  1N4001  [DO-214AC]
D33  LED2  [3.2X1.6X1.1]  (value not drawn)
D34  LED2  [3.2X1.6X1.1]  (value not drawn)
D35  LED-Gr  [3.2X1.6X1.1]
D36  1N4001  [DO-214AC]
D37  LED-Gr  [3.2X1.6X1.1]
D38  1N4001  [DO-214AC]
D39  LED-Gr  [3.2X1.6X1.1]
D40  LED2  [3.2X1.6X1.1]  (value not drawn)
D41  LED2  [3.2X1.6X1.1]  (value not drawn)
J8  TB1300  [TB-1300-0-C]
J9  TB1300  [TB-1300-0-C]
J10  TB1300  [TB-1300-0-C]
J11  TB1300  [TB-1300-0-C]
K7  JQX-16F  [JQX-16f]
K8  JQX-16F  [JQX-16f]
K9  JQX-16F  [JQX-16f]
K10  JQX-16F  [JQX-16f]
L27  FeILB
L28  FeILB
L29  FeILB
L30  FeILB
L31  FeILB
L32  FeILB
L33  FeILB
L34  FeILB
L35  FeILB
L36  FeILB
L37  FeILB
L38  FeILB
L39  FeILB
L40  FeILB
L41  FeILB
L42  FeILB
M2  MRF24J40MA
Q8  MMBT2222  [SOT23-BCE]
Q9  MMBT2222  [SOT23-BCE]
Q10  MMBT2222  [SOT23-BCE]
Q11  MMBT2222  [SOT23-BCE]
R96  1K  [0805R-10]
R97  1.54  [0805R-10]
R98  1K  [0805R-10]
R99  45  [0805R-68]
R100  453K/1%/ .5W  [1210R-GENERIC]
R101  45.3K /1%/.5W  [1210C-GENERIC]
R102  665/.1%/.5W  [1210C-GENERIC]
R103  470  [0805R-39]
R104  2K  [0805R-180]
R105  1K  [0805R-10]
R106  45  [0805R-68]
R107  1.54  [0805R-10]
R108  1K  [0805R-10]
R109  470  [0805R-39]
R110  453K/1%/ .5W  [1210R-GENERIC]
R111  45.3K /1%/.5W  [1210C-GENERIC]
R112  665/.1%/.5W  [1210C-GENERIC]
R113  2K  [0805R-180]
R114  220  [J1-0603]
R115  45  [0805R-68]
R116  470  [0805R-39]
R117  1K  [0805R-10]
R118  2K  [0805R-180]
R119  1.54  [0805R-10]
R120  45  [0805R-68]
R121  1K  [0805R-10]
R122  453K/1%/ .5W  [1210R-GENERIC]
R123  45.3K /1%/.5W  [1210C-GENERIC]
R124  470  [0805R-39]
R125  665/.1%/.5W  [1210C-GENERIC]
R126  2K  [0805R-180]
R127  1K  [0805R-10]
R128  1.54  [0805R-10]
R129  1K  [0805R-10]
R130  453K/1%/ .5W  [1210R-GENERIC]
R131  45.3K /1%/.5W  [1210C-GENERIC]
R132  665/.1%/.5W  [1210C-GENERIC]
R133  220  [J1-0603]
U16  4N25  [4N25]
U17  STPM34  [QFN32_M]
U18  4N25  [4N25]
U19  4N25  [4N25]
U20  STPM34  [QFN32_M]
U21  4N25  [4N25]

### Ports
ChipSel, CLK-SPI, CS_4, CS_5, Enable, Int, K7-1, K7-2, K8-1, K8-2, K9-1, K9-2, K10-1, K10-2, MISO, MOSI, Phase L (see Sheet1[1A]), Phase N (see Sheet1[1A]), Port, Relay7, Relay8, Relay9, Relay10, Reset, SCK, SDI, SDO, Wave

### Nets
A: C77.1 C78.2 C79.1 C80.1 C81.2 C84.1 C89.1 C90.2 C91.1 C92.1 C93.2 C97.1 L30.1 L34.1 L38.1 L42.1 R102.2 R125.2 R132.2 U17.10(VIN1) U17.16(VIP2) U20.10(VIN1) U20.16(VIP2)
GND: C74.2 C76.2 C82.2 C83.1 C85.1 C86.2 C88.2 C94.2 C95.1 C96.1 M2.1(GND) M2.11(GND) M2.12(GND) U17.20(GNDA) U17.25(GNDD) U17.26(GNDD) U20.20(GNDA) U20.25(GNDD) U20.26(GNDD)
Out-GND: Q8.E Q9.E Q10.E Q11.E R104.1 R113.1 R118.1 R126.1
VCC=3.3V: C75.1 C87.1 M2.10(Vin) R99.1 R106.1 R114.2 R115.1 R120.1 R133.2 U17.23(VCC) U20.23(VCC)
VCC=5.0V: D30.2(K) D32.2(K) D36.2(K) D38.2(K) K7.4 K8.4 K9.4 K10.4 U16.5(C) U18.5(C) U19.5(C) U21.5(C)
NetC74_1: C74.1 U17.27(VDDD)
NetC75_2: C75.2 U17.22(GND_REG)
NetC76_1: C76.1 U17.21(VDDA)
NetC77_2: C77.2 R96.2 U17.11(IIP1)
NetC78_1: C78.1 R98.2 U17.12(IIN1)
NetC79_2: C79.2 R101.1 R102.1 U17.9(VIP1)
NetC80_2: C80.2 R105.2 U17.13(IIP2)
NetC81_1: C81.1 R108.2 U17.14(IIN2)
NetC82_1: C82.1 U17.18(GND_REF)
NetC83_2: C83.2 U17.19(VREF)
NetC84_2: C84.2 R111.1 R112.1 U17.15(VIN2)
NetC85_2: C85.2 U17.17(VREF1)
NetC86_1: C86.1 U20.27(VDDD)
NetC87_2: C87.2 U20.22(GND_REG)
NetC88_1: C88.1 U20.21(VDDA)
NetC89_2: C89.2 R117.2 U20.11(IIP1)
NetC90_1: C90.1 R121.2 U20.12(IIN1)
NetC91_2: C91.2 R123.1 R125.1 U20.9(VIP1)
NetC92_2: C92.2 R127.2 U20.13(IIP2)
NetC93_1: C93.1 R129.2 U20.14(IIN2)
NetC94_1: C94.1 U20.18(GND_REF)
NetC95_2: C95.2 U20.19(VREF)
NetC96_2: C96.2 U20.17(VREF1)
NetC97_2: C97.2 R131.1 R132.1 U20.15(VIN2)
NetCT7_2: CT7.2 L28.1 R97.2
NetCT7_4: CT7.4 L29.1 R97.1
NetCT7_11: CT7.11 K7.2 R100.2 ; port K7-2
NetCT7_12: CT7.12 J8.2
NetCT8_2: CT8.2 L32.1 R107.2
NetCT8_4: CT8.4 L33.1 R107.1
NetCT8_11: CT8.11 K8.2 R110.2 ; port K8-2
NetCT8_12: CT8.12 J9.2
NetCT9_2: CT9.2 L36.1 R119.2
NetCT9_4: CT9.4 L37.1 R119.1
NetCT9_11: CT9.11 K9.2 R122.2 ; port K9-2
NetCT9_12: CT9.12 J10.2
NetCT10_2: CT10.2 L40.1 R128.2
NetCT10_4: CT10.4 L41.1 R128.1
NetCT10_11: CT10.11 K10.2 R130.2 ; port K10-2
NetCT10_12: CT10.12 J11.2
NetD30_1: D30.1(A) K7.5 Q8.C
NetD31_1: D31.1(A) U16.2(K)
NetD31_2: D31.2(K) ; port Relay7
NetD32_1: D32.1(A) K8.5 Q9.C
NetD33_1: D33.1(A) D34.1(A) R114.1
NetD33_2: D33.2(K) U17.4(LED1)
NetD34_2: D34.2(K) U17.5(LED2)
NetD35_1: D35.1(A) U18.2(K)
NetD35_2: D35.2(K) ; port Relay8
NetD36_1: D36.1(A) K9.5 Q10.C
NetD37_1: D37.1(A) U19.2(K)
NetD37_2: D37.2(K) ; port Relay9
NetD38_1: D38.1(A) K10.5 Q11.C
NetD39_1: D39.1(A) U21.2(K)
NetD39_2: D39.2(K) ; port Relay10
NetD40_1: D40.1(A) D41.1(A) R133.1
NetD40_2: D40.2(K) U20.4(LED1)
NetD41_2: D41.2(K) U20.5(LED2)
NetJ8_1: J8.1 L27.1 ; port Phase L
NetJ8_3: J8.3 L30.2 ; port Phase N
NetJ9_1: J9.1 L31.1
NetJ9_3: J9.3 L34.2
NetJ10_1: J10.1 L35.1
NetJ10_3: J10.3 L38.2
NetJ11_1: J11.1 L39.1
NetJ11_3: J11.3 L42.2
NetK7_1: K7.1 L27.2 ; port K7-1
NetK8_1: K8.1 L31.2 ; port K8-1
NetK9_1: K9.1 L35.2 ; port K9-1
NetK10_1: K10.1 L39.2 ; port K10-1
NetL28_2: L28.2 R96.1
NetL29_2: L29.2 R98.1
NetL32_2: L32.2 R105.1
NetL33_2: L33.2 R108.1
NetL36_2: L36.2 R117.1
NetL37_2: L37.2 R121.1
NetL40_2: L40.2 R127.1
NetL41_2: L41.2 R129.1
NetM2_2: M2.2(RESET) ; port Reset
NetM2_3: M2.3(WAVE) ; port Wave
NetM2_4: M2.4(INT) ; port Int
NetM2_5: M2.5(SDI) ; port SDI
NetM2_6: M2.6(SCL) ; port SCK
NetM2_7: M2.7(SDO) ; port SDO
NetM2_8: M2.8(CS) ; port ChipSel
NetQ8_B: Q8.B R103.2 R104.2
NetQ9_B: Q9.B R109.2 R113.2
NetQ10_B: Q10.B R116.2 R118.2
NetQ11_B: Q11.B R124.2 R126.2
NetR37_1: U17.8(EN) U20.8(EN) ; port Enable
NetR99_2: R99.2 U16.1(A)
NetR100_1: R100.1 R101.2
NetR103_1: R103.1 U16.4(E)
NetR106_2: R106.2 U18.1(A)
NetR109_1: R109.1 U18.4(E)
NetR110_1: R110.1 R111.2
NetR115_2: R115.2 U19.1(A)
NetR116_1: R116.1 U19.4(E)
NetR120_2: R120.2 U21.1(A)
NetR122_1: R122.1 R123.2
NetR124_1: R124.1 U21.4(E)
NetR130_1: R130.1 R131.2
NetU5_30: U17.30(SCL) U20.30(SCL) ; port CLK-SPI
NetU5_31: U17.31(MOSI) U20.31(MOSI) ; port MOSI
NetU5_32: U17.32(MISO) U20.32(MISO) ; port MISO
NetU6_14: U17.29(SCS) ; port CS_4
NetU6_62: U17.2(XTAL2) ; port Port
NetU17_1: U17.1(CLKOUT) U20.2(XTAL2)
NetU20_29: U20.29(SCS) ; port CS_5

Not connected (* = marked no-connect by the designer): K7 3; K8 3; K9 3; K10 3; M2 9(NC); R112 2; U16 6(B); U17 3(XTAL1) 6(INT1) 7(INT2) 24(NC) 28(SYN); U18 6(B); U19 6(B); U20 1(CLKOUT) 3(XTAL1) 6(INT1) 7(INT2) 24(NC) 28(SYN); U21 6(B)

### Notes on the sheet
- (near R96) /1%
- (near R96) /.125W
- 1%
- .5W
- (near R98) /1%
- (near R98) /.125W
- (near R99) 1%/.125W
- (near R103) 1%/.125W
- 1%/.125W
- (near R105) /1%
- /.125W
- (near R106) 1%/.125W
- (near R108) /1%
- (near R108) /.125W
- (near R109) 1%/.125W
- (near R114) /1%
- (near R114) /.125W
- (near R115) 1%/.125W
- (near R116) 1%/.125W
- (near R117) /1%
- (near R121) /1%
- (near R121) /.125W
- (near R124) 1%/.125W
- (near R127) /1%
- (near R127) /.125W
- (near R129) /1%
- (near R129) /.125W
- (near R133) /1%
- (near R133) /.125W
- (in symbol MRF24J40MA) ANTENNA

### Library data of the parts
C74 C75 C86 C87 = Cap Pol3: as C25 on sheet Sheet2; Published: 8-Jun-2000; LatestRevisionDate: 29-May-2009; LatestRevisionNote: IPC-7351 Footprint Added.; PackageReference: C0805; Publisher: Altium Limited; PackageDescription: Chip Capacitor; Supplier: Digi-Key; SMD: 1206; Price: .065
C76 C82 C88 C94 = Cap Pol3: as C27 on sheet Sheet2; Published: 8-Jun-2000; LatestRevisionDate: 29-May-2009; LatestRevisionNote: IPC-7351 Footprint Added.; PackageReference: C0805; Publisher: Altium Limited; PackageDescription: Chip Capacitor; Supplier: Digi-Key; SMD: 0402; Price: .4
C77-C81 C84 C89-C93 C97 = 0805C-18PF-50V-C0G-JOH: as C28 on sheet Sheet2; Supplier 1: Digi-Key; Supplier Part Number 1: 709-1171-2-ND; Value: 10n; mfr PN: *; Package reference: 0805-TBD; Supplier: Digi-Key; smd: 0402; Price: .002
C83 C85 C95 C96 = 0805C-18PF-50V-C0G-JOH: as C29 on sheet Sheet2; Supplier 1: Digi-Key; Supplier Part Number 1: 709-1171-2-ND; mfr PN: *; Package reference: 0805-TBD; Supplier: Digi-Key; SMD: 0402
CT7-CT10 = CurrentTransf: as CT1 on sheet Sheet2; Price: 1.14
D30 D32 D36 D38 = Diode 1N4001: as D12 on sheet Sheet2; Published: 8-Jun-2000; LatestRevisionDate: 17-Jul-2002; LatestRevisionNote: Re-released for DXP Platform.; DatasheetVersion: 1998; PackageVersion: Aug-1999; PackageReference: DO-41; Publisher: Altium Limited; PackageDescription: Diode, Axial; Body 5.2 x 2.7 mm (LxDia. max), Lead Dia. 0.86 mm (max); Code_JEDEC: DO-204-AL; ComponentLink1Description: Manufacturer Link; ComponentLink1URL: http://www.fairchildsemi.com/; ComponentLink2Description: Datasheet; ComponentLink2URL: http://www.fairchildsemi.com/ds/1N%2F1N4001.pdf; Supplier: Digi-Key; Price: .1
D31 D35 D37 D39 = LED2: as D13 on sheet Sheet2; Published: 8-Jun-2000; LatestRevisionDate: 17-Jul-2002; LatestRevisionNote: Re-released for DXP Platform.; PackageVersion: Feb-2002; PackageReference: 3.2X1.6X1.1; Publisher: Altium Limited; PackageDescription: SM LED; 2 Flat Leads; Supplier: Digi-Key; Price: .04
D33 D34 D40 D41 = LED2: as D28 on sheet Sheet2; Published: 8-Jun-2000; LatestRevisionDate: 17-Jul-2002; LatestRevisionNote: Re-released for DXP Platform.; PackageVersion: Feb-2002; PackageReference: 3.2X1.6X1.1; Publisher: Altium Limited; PackageDescription: SM LED; 2 Flat Leads; Price: .04; Supplier: Digi-Key
J8-J11 = TermBlock-2: as J2 on sheet Sheet2; Price: .3
K7-K10 = Relay-SPDT: as K1 on sheet Sheet2; Published: 24-Mar-1999; LatestRevisionDate: 17-Jul-2002; LatestRevisionNote: Re-released for DXP Platform.; PackageReference: MODULE5B; Publisher: Altium Limited; Supplier: Shanghai Shinvo Electric Co.Ltd; Price: .2
L27-L42 = FerrBeads/ILBB: as L3 on sheet Sheet2; Supplier: Digi-Key; Price: .027
M2 = MRF24J40MA: Manufacturer: Microchip; Mfr.PN#: MRF24J40M-I/RM; Suppl.PN#: MRF24J40M-I/RMCT-ND; Supplier: Digi-Key; Price: 6.08
Q8-Q11 = MMBT2222: as Q2 on sheet Sheet2; Supplier 1: Digi-Key; Supplier Part Number 1: MMBT2222A-FDICT-ND; Supplier: Digi-Key; Package: SOT-323; Price: .03
R96 R98 R105 R108 R117 R121 R127 R129 = Res3: as R33 on sheet Sheet2; Published: 8-Jun-2000; LatestRevisionDate: 29-May-2009; LatestRevisionNote: IPC-7351 Footprint Added.; PackageReference: J1-0603; Publisher: Altium Limited; PackageDescription: Chip Resistor; Supplier: Digi-Key; Price: .05
R97 R107 R119 R128 = Res3: as R34 on sheet Sheet2; Published: 8-Jun-2000; LatestRevisionDate: 29-May-2009; LatestRevisionNote: IPC-7351 Footprint Added.; PackageReference: J1-0603; Publisher: Altium Limited; PackageDescription: Chip Resistor; Supplier: Digi-Key; Price: .05; SMD: 1206
R99 R106 R115 R120 = Res3: as R42 on sheet Sheet2; Published: 8-Jun-2000; LatestRevisionDate: 29-May-2009; LatestRevisionNote: IPC-7351 Footprint Added.; PackageReference: J1-0603; Publisher: Altium Limited; PackageDescription: Chip Resistor; mfr PN: *; Supplier: Digi-Key
R100 R110 R122 R130 = Res3: as R38 on sheet Sheet2; Published: 8-Jun-2000; LatestRevisionDate: 29-May-2009; LatestRevisionNote: IPC-7351 Footprint Added.; PackageReference: J1-0603; Publisher: Altium Limited; PackageDescription: Chip Resistor; mfr PN: *; Package Reference: 1206; Supplier: Digi-Key; SMD: 1210; Price: .055
R101 R111 R123 R131 = Res3: as R39 on sheet Sheet2; Published: 8-Jun-2000; LatestRevisionDate: 29-May-2009; LatestRevisionNote: IPC-7351 Footprint Added.; PackageReference: J1-0603; Publisher: Altium Limited; PackageDescription: Chip Resistor; mfr PN: *; Package Reference: 1206; Supplier: Digi-key; SMD: 1210; Price: .035
R102 R112 R125 R132 = Res3: as R40 on sheet Sheet2; Published: 8-Jun-2000; LatestRevisionDate: 29-May-2009; LatestRevisionNote: IPC-7351 Footprint Added.; PackageReference: J1-0603; Publisher: Altium Limited; PackageDescription: Chip Resistor; Supplier: Digi-Key; SMD: 0805; Price: .02
R103 R109 R116 R124 = Res3: as R45 on sheet Sheet2; Published: 8-Jun-2000; LatestRevisionDate: 29-May-2009; LatestRevisionNote: IPC-7351 Footprint Added.; PackageReference: J1-0603; Publisher: Altium Limited; PackageDescription: Chip Resistor; Supplier: Digi-Key; Price: .003
R104 R113 R118 R126 = Res3: as R49#1 on sheet Sheet2; Published: 8-Jun-2000; LatestRevisionDate: 29-May-2009; LatestRevisionNote: IPC-7351 Footprint Added.; PackageReference: J1-0603; Publisher: Altium Limited; PackageDescription: Chip Resistor; Supplier: Digi-Key; Price: .033
R114 R133 = Res3: as R36 on sheet Sheet2; Published: 8-Jun-2000; LatestRevisionDate: 29-May-2009; LatestRevisionNote: IPC-7351 Footprint Added.; PackageReference: J1-0603; Publisher: Altium Limited; PackageDescription: Chip Resistor; manufacture P/N: *; Supplier: Digi-Key; Price: .0027
U16 U18 U19 U21 = Optoisolator2: as U7 on sheet Sheet2; Published: 24-Mar-1999; LatestRevisionDate: 04-Mar-2005; LatestRevisionNote: PCB Footprint replaced, Sch pins re-numbered.; DatasheetVersion: Apr-2004; PackageReference: SOP5(6); Publisher: Altium Limited; PackageDescription: Small Outline; 6 Leads (1 Absent); Body Width 4.4 mm; Pitch 1.27 mm; Supplier: Arrow; Price: .1273
U17 U20 = STPM34: as U5 on sheet Sheet2; Supplier: Digi-Key; Price: 1.16

## Nets that join several sheets
A: Sheet2 (35 pins), Sheet3 (23 pins)
GND: Sheet2 (48 pins), Sheet3 (19 pins)
Out-GND: Sheet2 (12 pins), Sheet3 (8 pins)
VCC=3.3V: Sheet2 (32 pins), Sheet3 (11 pins)
VCC=5.0V: Sheet2 (17 pins), Sheet3 (12 pins)
NetD31_2: Sheet2 (U6.48), Sheet3 (D31.2)
NetD35_2: Sheet2 (U6.47), Sheet3 (D35.2)
NetD37_2: Sheet2 (U6.21), Sheet3 (D37.2)
NetD39_2: Sheet2 (U6.18), Sheet3 (D39.2)
NetM2_2: Sheet2 (U6.24), Sheet3 (M2.2)
NetM2_3: Sheet2 (U6.43), Sheet3 (M2.3)
NetM2_4: Sheet2 (U6.46), Sheet3 (M2.4)
NetM2_5: Sheet2 (U6.32 U12.5), Sheet3 (M2.5)
NetM2_6: Sheet2 (U6.29 U12.6), Sheet3 (M2.6)
NetM2_7: Sheet2 (U6.31 U12.2), Sheet3 (M2.7)
NetM2_8: Sheet2 (U6.23), Sheet3 (M2.8)
NetR37_1: Sheet2 (R37.1 U5.8 U9.8 U14.8), Sheet3 (U17.8 U20.8)
NetU5_30: Sheet2 (U5.30 U6.4 U9.30 U14.30), Sheet3 (U17.30 U20.30)
NetU5_31: Sheet2 (U5.31 U6.6 U9.31 U14.31), Sheet3 (U17.31 U20.31)
NetU5_32: Sheet2 (U5.32 U6.5 U9.32 U14.32), Sheet3 (U17.32 U20.32)
NetU6_14: Sheet2 (U6.14), Sheet3 (U17.29)
NetU6_62: Sheet2 (U6.62), Sheet3 (U17.2)